# EAGLE schematic LiBatteryChargeBoostBoard (EAGLE 9.6.2)
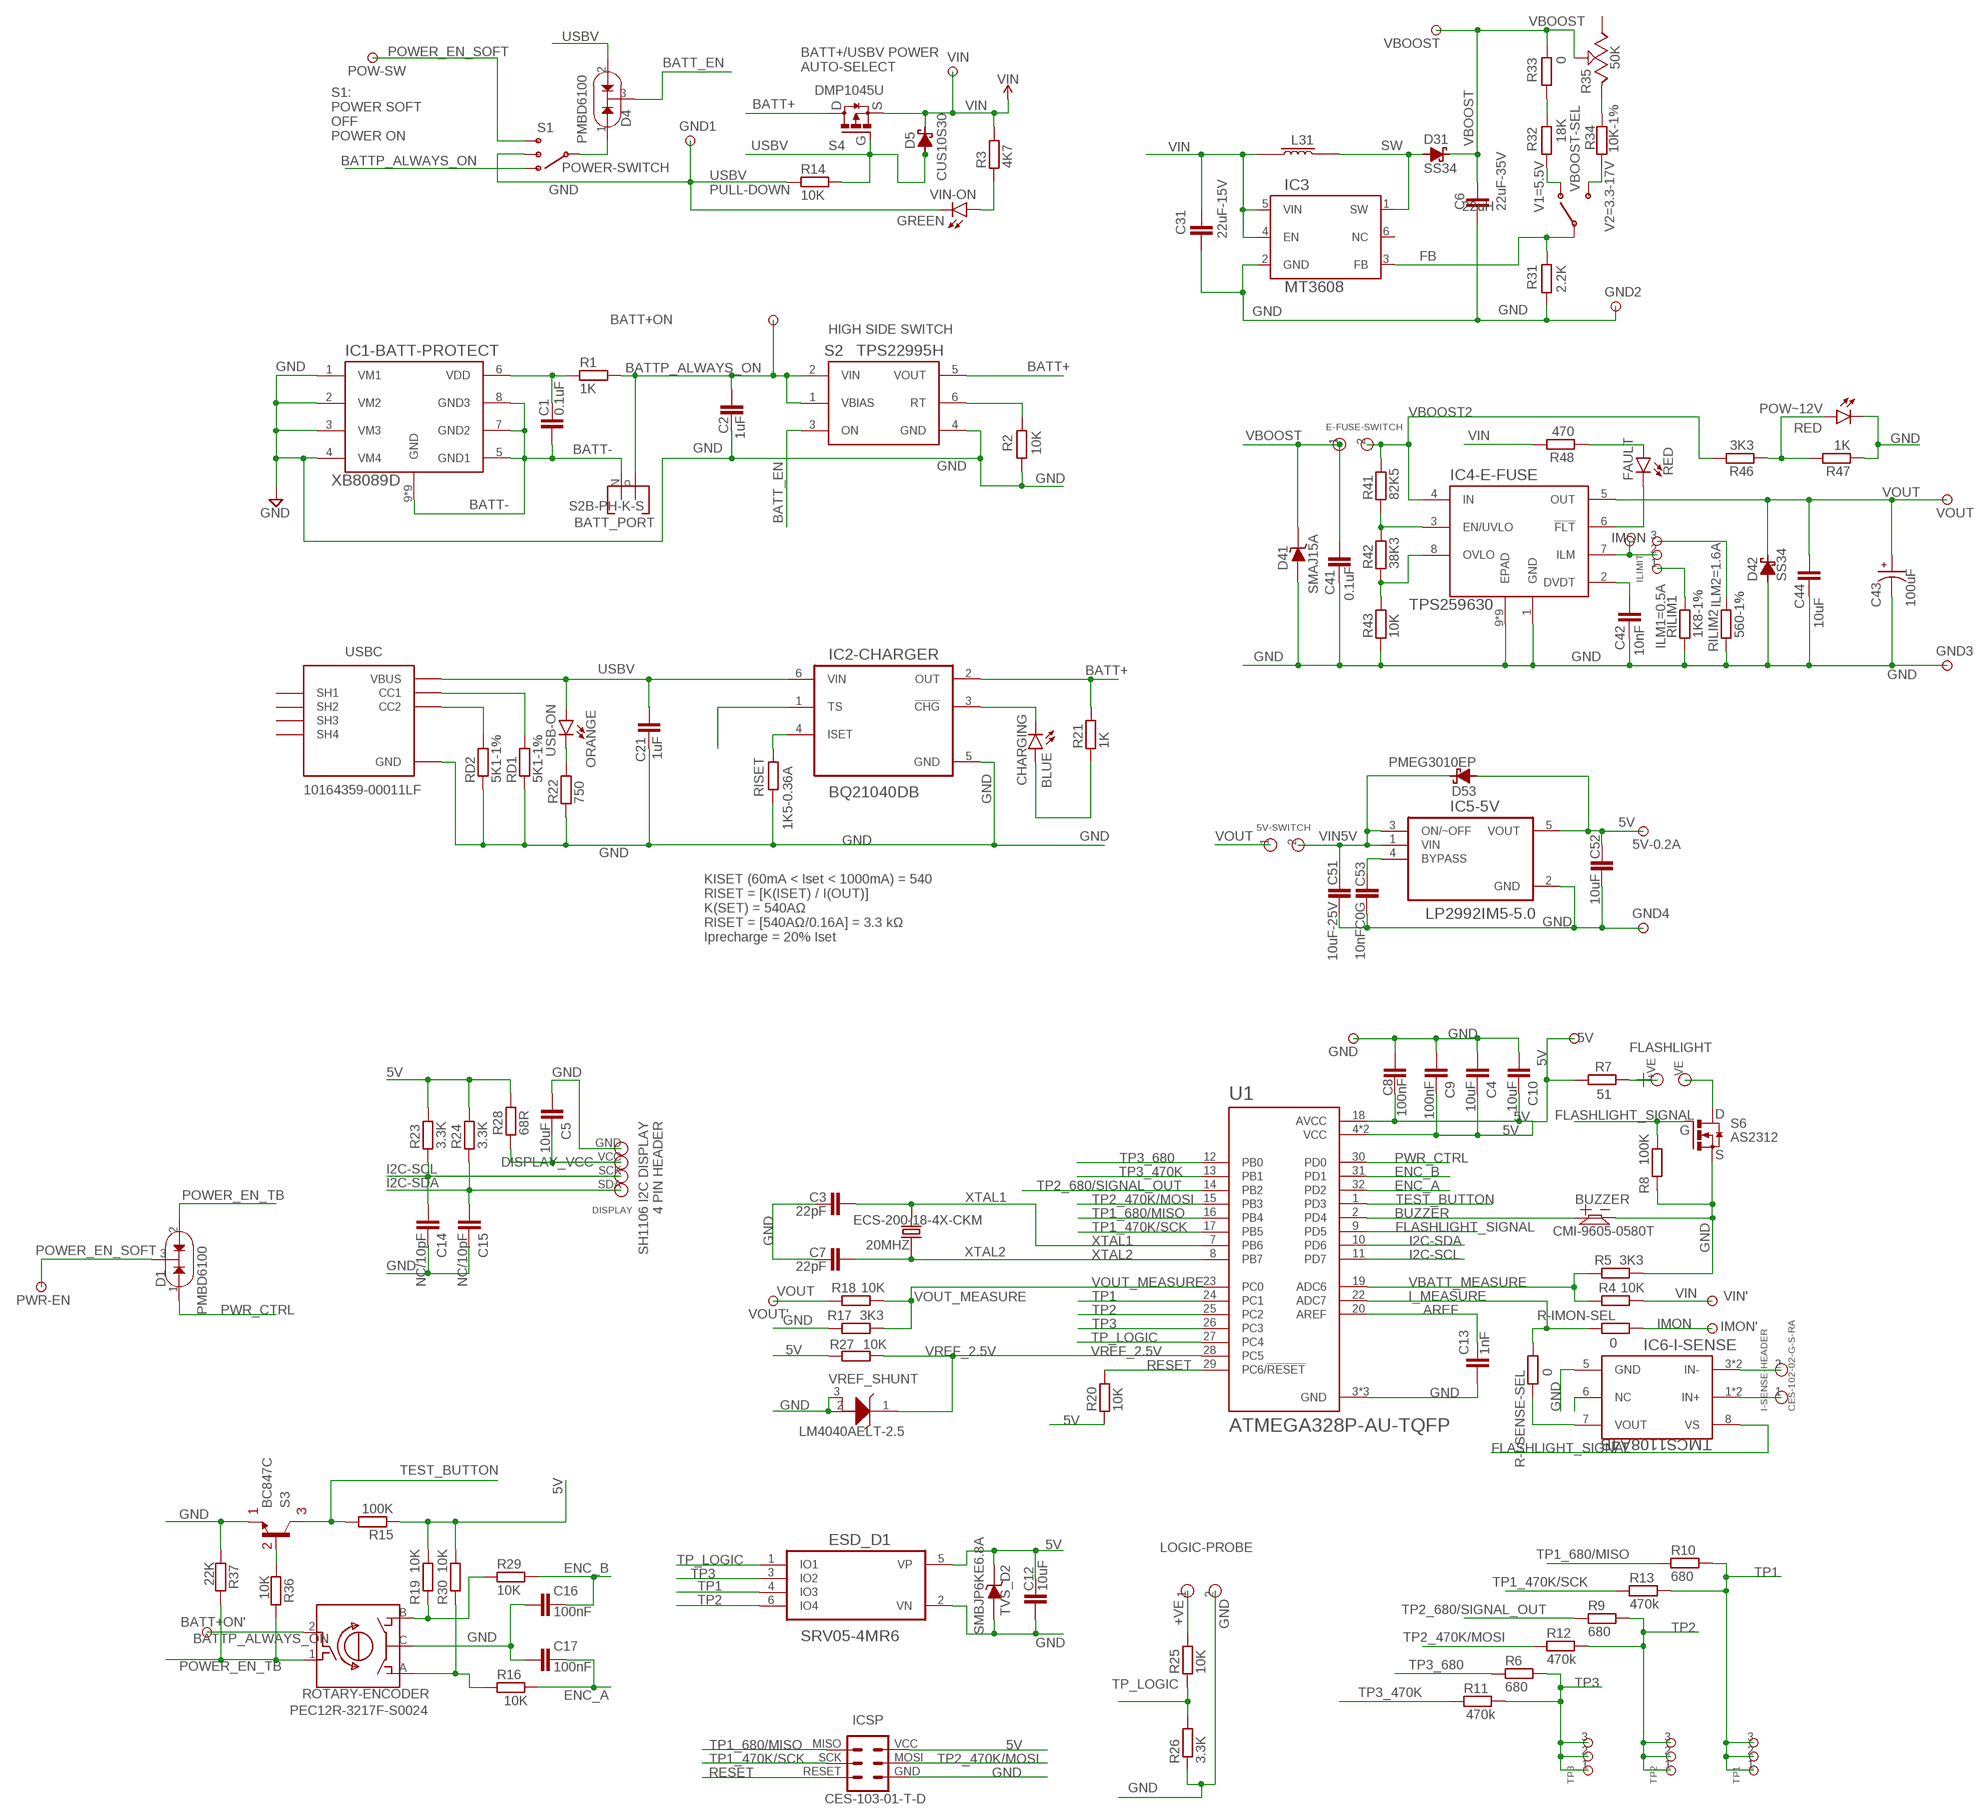
[diagram p0: schematic, sheet 1]

## Parts
5V  TEST-POINT-TH  [TEST-POINT-TH-1MM]
5V-0.2A  TEST-POINT-TH  [TEST-POINT-TH-1MM]
5V-SWITCH  HEADER-2PIN-0.1"P  [HEADER-2PIN-0.1"P]
20MHZ  ECS-200-18-4X-CKM  CRYSTAL-20MHZ-ECS-200-18-4X-CKM  [XTAL_ECS-200-18-4X-CKM]
BATT+ON  TEST-POINT-TH  [TEST-POINT-TH-1MM]
BATT+ON'  TEST-POINT-TH  [TEST-POINT-TH-1MM]
BATT_PORT  S2B-PH-K-S  [S2B-PH-K-S]
BUZZER  CMI-9605-0580T  BUZZER-ACTIVE-CMI-9605-0580T  [BUZZER-ACTIVE-CMI-9605-0580T]
C1  0.1uF  CAPACITOR_SMD0603  [0603]
C2  1uF  CAPACITOR_SMD0603  [0603]
C3  22pF  CAPACITOR_SMD0603  [0603]
C4  10uF  CAPACITOR_SMD0603  [0603]
C5  10uF  CAPACITOR1206  [1206]
C6  22uF-35V  CAPACITOR_SMD1206  [1206]
C7  22pF  CAPACITOR_SMD0603  [0603]
C8  100nF  CAPACITOR_SMD0603  [0603]
C9  100nF  CAPACITOR_SMD0603  [0603]
C10  10uF  CAPACITOR_SMD0603  [0603]
C12  10uF  CAPACITOR_SMD0603  [0603]
C13  1nF  CAPACITOR_SMD0603  [0603]
C14  NC/10pF  CAPACITOR_SMD0603  [0603]
C15  NC/10pF  CAPACITOR_SMD0603  [0603]
C16  100nF  CAPACITOR_SMD0603  [0603]
C17  100nF  CAPACITOR_SMD0603  [0603]
C21  1uF  CAPACITOR_SMD0603  [0603]
C31  22uF-15V  CAPACITOR_SMD1206  [1206]
C41  0.1uF  CAPACITOR_SMD0603  [0603]
C42  10nF  CAPACITOR_SMD0603  [0603]
C43  100uF  EEEFN1E101UP  [CAP_EEEFN1E101UP]
C44  10uF  CAPACITOR_SMD0603  [0603]
C51  10uF-25V  CAPACITOR0603  [0603]
C52  10uF  CAPACITOR0603  [0603]
C53  10nFC0G  CAPACITOR_SMD0603  [0603]
CHARGING  BLUE  LED0603  [0603-DIODE]
D1  PMBD6100  DIODE-DOUBLE-COMMON-CATHODE-PMBD6100,215  [SOT-23-3]
D4  PMBD6100  DIODE-DOUBLE-COMMON-CATHODE-PMBD6100,215  [SOT-23-3]
D5  CUS10S30  DIODE-SCHOTTKY-CUS10S30,H3F  [SOD-323]
D31  SS34  DIODE-SCHOTTKY-SS34  [SMA]
D41  SMAJ15A  DIODE-TVS-SMA  [SMA]
D42  SS34  DIODE-SCHOTTKY-SS34  [SMA]
D53  PMEG3010EP  DIODE-SCHOTTKY-PMEG3010EP,115  [SOD-128]
DISPLAY  DISPLAY-1.3"-SH1106-I2C  [DISPLAY-1.3"-SH1106-I2C]
E-FUSE-SWITCH  HEADER-2PIN-0.1"P  [HEADER-2PIN-0.1"P]
ESD_D1  SRV05-4MR6  SRV05-4MR6T1G  [SOT-23-6]
FAULT  RED  LED0603  [0603-DIODE]
FLASHLIGHT  HEADER-2PIN-0.2"P  [HEADER-2PIN-0.2"P]
GND  TEST-POINT-TH  [TEST-POINT-TH-1MM]
GND1  TEST-POINT-TH  [TEST-POINT-TH-1MM]
GND2  TEST-POINT-TH  [TEST-POINT-TH-1MM]
GND3  TEST-POINT-TH  [TEST-POINT-TH-1MM]
GND4  TEST-POINT-TH  [TEST-POINT-TH-1MM]
I-SENSE-HEADER  CES-102-02-G-S-RA  HEADER-2PIN-0.1"P  [HEADER-2PIN-0.1"P]
IC1-BATT-PROTECT  XB8089D  [SOIC-8-POWER-PAD]
IC2-CHARGER  BQ21040DB  BQ21040DBVR  [SOT-23-6]
IC3  MT3608  [SOT-23-6]
IC4-E-FUSE  TPS259630  TPS259621DDAR  [SOIC-8-POWER-PAD]
IC5-5V  LP2992IM5-5.0  [SOT-23-5]
IC6-I-SENSE  TMCS1108A4B  TMCS1108A4B-CURRENT-SENSE  [SOIC-8]
ICSP  CES-103-01-T-D  HEADER-ICSP-0.1"P  [HEADER-ICSP-0.1"P]
ILIMIT  HEADER-3PIN-0.1"P  [HEADER-3PIN-0.1"P]
IMON  TEST-POINT-TH  [TEST-POINT-TH-1MM]
IMON'  TEST-POINT-TH  [TEST-POINT-TH-1MM]
L31  22uH  INDUCTOR-SMRH74-220MT  [INDUCTOR-SMRH74-220MT]
LOGIC-PROBE  HEADER-2PIN-0.1"P  [HEADER-2PIN-0.1"P]
POW-SW  TEST-POINT-TH  [TEST-POINT-TH-1MM]
POW~12V  RED  LED1206  [1206-DIODE]
PWR-EN  TEST-POINT-TH  [TEST-POINT-TH-1MM]
R1  1K  RESISTOR_SMD0603  [0603]
R2  10K  RESISTOR_SMD0603  [0603]
R3  4K7  RESISTOR_SMD0603  [0603]
R4  10K  RESISTOR_SMD0603  [0603]
R5  3K3  RESISTOR_SMD0603  [0603]
R6  680  RESISTOR_SMD1206  [1206]
R7  51  RESISTOR_SMD1206  [1206]
R8  100K  RESISTOR_SMD0603  [0603]
R9  680  RESISTOR_SMD1206  [1206]
R10  680  RESISTOR_SMD1206  [1206]
R11  470k  RESISTOR_SMD1206  [1206]
R12  470k  RESISTOR_SMD1206  [1206]
R13  470k  RESISTOR_SMD1206  [1206]
R14  10K  RESISTOR_SMD0603  [0603]
R15  100K  RESISTOR_SMD0603  [0603]
R16  10K  RESISTOR_SMD0603  [0603]
R17  3K3  RESISTOR_SMD0603  [0603]
R18  10K  RESISTOR_SMD0603  [0603]
R19  10K  RESISTOR_SMD0603  [0603]
R20  10K  RESISTOR_SMD0603  [0603]
R21  1K  RESISTOR_SMD0603  [0603]
R22  750  RESISTOR_SMD0603  [0603]
R23  3.3K  RESISTOR_SMD0603  [0603]
R24  3.3K  RESISTOR_SMD0603  [0603]
R25  10K  RESISTOR_SMD0603  [0603]
R26  3.3K  RESISTOR_SMD0603  [0603]
R27  10K  RESISTOR_SMD0603  [0603]
R28  68R  RESISTOR_SMD0603  [0603]
R29  10K  RESISTOR_SMD0603  [0603]
R30  10K  RESISTOR_SMD0603  [0603]
R31  2.2K  RESISTOR_SMD0603  [0603]
R32  18K  RESISTOR_SMD0603  [0603]
R33  0  RESISTOR_SMD0603  [0603]
R34  10K-1%  RESISTOR_SMD0603  [0603]
R35  50K  ROTARY-POTENTIOMETER-3386P-1-503TLF  [ROTARY-POTENTIOMETER-3386P]
R36  10K  RESISTOR_SMD0603  [0603]
R37  22K  RESISTOR_SMD0603  [0603]
R41  82K5  RESISTOR_SMD0603  [0603]
R42  38K3  RESISTOR_SMD0603  [0603]
R43  10K  RESISTOR_SMD0603  [0603]
R46  3K3  RESISTOR_SMD0603  [0603]
R47  1K  RESISTOR_SMD0603  [0603]
R48  470  RESISTOR_SMD0603  [0603]
R-I-SENSE-SEL  0  RESISTOR_SMD0603  [0603]
R-IMON-SEL  0  RESISTOR_SMD0603  [0603]
RD1  5K1-1%  RESISTOR_SMD0603  [0603]
RD2  5K1-1%  RESISTOR_SMD0603  [0603]
RILIM1  1K8-1%  RESISTOR_SMD0603  [0603]
RILIM2  560-1%  RESISTOR_SMD0603  [0603]
RISET  1K5-0.36A  RESISTOR_SMD0603  [0603]
ROTARY-ENCODER  PEC12R-3217F-S0024  [PEC12R-3217F-S0024]
S1  POWER-SWITCH  SLIDE-SWITCH-SP3T-VER-TH-MINI  [CSS-1310MC]
S2  TPS22995H  TPS22995H-Q1  [SOT-23-6]
S3  BC847C  [SOT-23-3]
S4  DMP1045U  [SOT-23-3]
S6  AS2312  AS2312AS2312  [SOT-23-3]
TP1  HEADER-3PIN-0.1"P  [HEADER-3PIN-0.1"P]
TP2  HEADER-3PIN-0.1"P  [HEADER-3PIN-0.1"P]
TP3  HEADER-3PIN-0.1"P  [HEADER-3PIN-0.1"P]
TVS_D2  SMBJP6KE6.8A  SMBJP6KE6.8A-TP  [DIOM5336X244N]
U1  ATMEGA328P-AU-TQFP  [TQFP32]
USB-ON  ORANGE  LED0603  [0603-DIODE]
USBC  10164359-00011LF  USB-C-RECEPTABLE-10164359-00011LF  [USB-C-RECEPTABLE-1016435900011LF]
VBOOST  TEST-POINT-TH  [TEST-POINT-TH-1MM]
VBOOST-SEL  SLIDE-SWITCH-SPDT-VERTICLE-TH  [SLW-883935-2A-D]
VIN  TEST-POINT-TH  [TEST-POINT-TH-1MM]
VIN'  TEST-POINT-TH  [TEST-POINT-TH-1MM]
VIN-ON  GREEN  LED0603  [0603-DIODE]
VOUT  TEST-POINT-TH  [TEST-POINT-TH-1MM]
VOUT'  TEST-POINT-TH  [TEST-POINT-TH-1MM]
VREF_SHUNT  LM4040AELT-2.5  LM4040AELT-2.5-SOT23  [SOT-23-3]

## Nets
5V: 5V-0.2A.P$1 5V.P$1 C4.1 C8.2 C9.1 C10.1 C12.1 C52.2 D53.A ESD_D1.5(VP) IC5-5V.5(VOUT) ICSP.VCC R7.1 R15.1 R19.2 R20.1 R23.2 R24.2 R27.1 R28.2 R30.2 TVS_D2.C U1.4(VCC) U1.6(VCC) U1.18(AVCC)
!FLT: FAULT.C IC4-E-FUSE.6(!FLT)
+VE: LOGIC-PROBE.1 R25.2
A: R16.1 R30.1 ROTARY-ENCODER.A
AREF: C13.1 U1.20(AREF)
B: R19.1 R29.1 ROTARY-ENCODER.B
BATT+: IC2-CHARGER.2(OUT) R21.2 S2.5(VOUT) S4.3(D)
BATT-: BATT_PORT.N C1.2 IC1-BATT-PROTECT.5(GND1) IC1-BATT-PROTECT.7(GND2) IC1-BATT-PROTECT.8(GND3) IC1-BATT-PROTECT.9(GND) IC1-BATT-PROTECT.10(GND) IC1-BATT-PROTECT.11(GND) IC1-BATT-PROTECT.12(GND) IC1-BATT-PROTECT.13(GND) IC1-BATT-PROTECT.14(GND) IC1-BATT-PROTECT.15(GND) IC1-BATT-PROTECT.16(GND) IC1-BATT-PROTECT.17(GND)
BATT_EN: D4.3(C) S2.3(ON)
BATTP_ALWAYS_ON: BATT+ON'.P$1 BATT+ON.P$1 BATT_PORT.P C2.2 R1.2 ROTARY-ENCODER.2 S1.1 S2.1(VBIAS) S2.2(VIN)
BJT-B: R36.1 S3.1(B)
BUZZER: BUZZER.P$1 U1.2(PD4)
BYP1: C53.2 IC5-5V.4(BYPASS)
CHG: CHARGING.C IC2-CHARGER.3(!CHG)
DISPLAY_VCC: C5.1 DISPLAY.VCC R28.1
DVDT: C42.2 IC4-E-FUSE.2(DVDT)
EN/UVLO: IC4-E-FUSE.3(EN/UVLO) R41.1 R42.2
ENC_A: C17.1 R16.2 U1.32(PD2)
ENC_B: C16.1 R29.2 U1.31(PD1)
FB: IC3.3(FB) R31.1 VBOOST-SEL.C
FL+: FLASHLIGHT.+VE R7.2
FL-: FLASHLIGHT.-VE S6.3(D)
FLASHLIGHT_SIGNAL: IC6-I-SENSE.8(VS) R8.1 S6.1(G) U1.9(PD5)
GND: BUZZER.P$2 C2.1 C3.1 C4.2 C5.2 C6.1 C7.1 C8.1 C9.2 C10.2 C12.2 C13.2 C14.1 C15.1 C16.2 C17.2 C21.1 C31.1 C41.1 C42.1 C43.2 C44.1 C51.1 C52.1 C53.1 D41.A D42.A DISPLAY.GND ESD_D1.2(VN) GND1.P$1 GND2.P$1 GND3.P$1 GND4.P$1 GND.P$1 IC1-BATT-PROTECT.1(VM1) IC1-BATT-PROTECT.2(VM2) IC1-BATT-PROTECT.3(VM3) IC1-BATT-PROTECT.4(VM4) IC2-CHARGER.5(GND) IC3.2(GND) IC4-E-FUSE.1(GND) IC4-E-FUSE.9(EPAD) IC4-E-FUSE.10(EPAD) IC4-E-FUSE.11(EPAD) IC4-E-FUSE.12(EPAD) IC4-E-FUSE.13(EPAD) IC4-E-FUSE.14(EPAD) IC4-E-FUSE.15(EPAD) IC4-E-FUSE.16(EPAD) IC4-E-FUSE.17(EPAD) IC5-5V.2(GND) IC6-I-SENSE.5(GND) ICSP.GND LOGIC-PROBE.2 POW~12V.C R2.2 R5.2 R8.2 R14.1 R17.1 R22.1 R26.1 R31.2 R37.1 R43.1 R47.1 RD1.1 RD2.1 RILIM1.1 RILIM2.1 RISET.2 ROTARY-ENCODER.C S1.2 S2.4(GND) S3.2(E) S6.2(S) TVS_D2.A U1.3(GND) U1.5(GND) U1.21(GND) USBC.A12(GND) USBC.B12(GND) VIN-ON.C VREF_SHUNT.2(A) VREF_SHUNT.3(NC/A)
I2C-SCL: C14.2 DISPLAY.SCK R23.1 U1.11(PD7)
I2C-SDA: C15.2 DISPLAY.SDA R24.1 U1.10(PD6)
I_MEASURE: R-I-SENSE-SEL.1 R-IMON-SEL.2 U1.22(ADC7)
ILM1: ILIMIT.1 RILIM1.2
ILM2: ILIMIT.3 RILIM2.2
IMEASURE: IC6-I-SENSE.7(VOUT) R-I-SENSE-SEL.2
IMON: IC4-E-FUSE.7(ILM) ILIMIT.2 IMON'.P$1 IMON.P$1 R-IMON-SEL.1
IN+: I-SENSE-HEADER.1 IC6-I-SENSE.1(IN+) IC6-I-SENSE.2(IN+)
IN-: I-SENSE-HEADER.2 IC6-I-SENSE.3(IN-) IC6-I-SENSE.4(IN-)
ISET: IC2-CHARGER.4(ISET) RISET.1
N$1: RD2.2 USBC.B5(CC2)
N$2: RD1.2 USBC.A5(CC1)
N$3: R22.2 USB-ON.C
N$4: R32.2 VBOOST-SEL.1
N$5: R3.1 VIN-ON.A
N$7: FAULT.A R48.1
N$10: CHARGING.A R21.1
N$12: R32.1 R33.2
N$13: R34.2 VBOOST-SEL.2
N$18: POW~12V.A R46.1 R47.2
N$21: R34.1 R35.3(CCW)
NC: IC6-I-SENSE.6(NC)
OVLO: IC4-E-FUSE.8(OVLO) R42.1 R43.2
POWER_EN_SOFT: D1.3(C) POW-SW.P$1 PWR-EN.P$1 S1.3
POWER_EN_TB: D1.2(A2) R36.2 R37.2 ROTARY-ENCODER.1
PWR_CTRL: D1.1(A1) U1.30(PD0)
PWR_SW: D4.1(A1) S1.C
RESET: ICSP.RESET R20.2 U1.29(PC6/!RESET)
RT: R2.1 S2.6(RT)
SW: D31.A IC3.1(SW) L31.P$2
TEST_BUTTON: R15.2 S3.3(C) U1.1(PD3)
TP1: ESD_D1.4(IO3) R10.2 R13.2 TP1.1 TP1.2 TP1.3 U1.24(PC1)
TP1_470K/SCK: ICSP.SCK R13.1 U1.17(PB5)
TP1_680/MISO: ICSP.MISO R10.1 U1.16(PB4)
TP2: ESD_D1.6(IO4) R9.2 R12.2 TP2.1 TP2.2 TP2.3 U1.25(PC2)
TP2_470K/MOSI: ICSP.MOSI R12.1 U1.15(PB3)
TP2_680/SIGNAL_OUT: R9.1 U1.14(PB2)
TP3: ESD_D1.3(IO2) R6.2 R11.2 TP3.1 TP3.2 TP3.3 U1.26(PC3)
TP3_470K: R11.1 U1.13(PB1)
TP3_680: R6.1 U1.12(PB0)
TP_LOGIC: ESD_D1.1(IO1) R25.1 R26.2 U1.27(PC4)
TS: IC2-CHARGER.1(TS)
USBV: C21.2 D4.2(A2) D5.A IC2-CHARGER.6(VIN) R14.2 S4.1(G) USB-ON.A USBC.A9(VBUS) USBC.B9(VBUS)
VBATT_MEASURE: R4.2 R5.1 U1.19(ADC6)
VBOOST: C6.2 C41.2 D31.C D41.C E-FUSE-SWITCH.1 R33.1 R35.2(S) VBOOST.P$1
VBOOST2: E-FUSE-SWITCH.2 IC4-E-FUSE.4(IN) R41.2 R46.2
VDD: C1.1 IC1-BATT-PROTECT.6(VDD) R1.1
VIN: C31.2 D5.C IC3.4(EN) IC3.5(VIN) L31.P$1 R3.2 R4.1 R48.2 S4.2(S) VIN'.P$1 VIN.P$1
VIN5V: 5V-SWITCH.2 C51.2 D53.K(C) IC5-5V.1(VIN) IC5-5V.3(ON/~OFF)
VOUT: 5V-SWITCH.1 C43.1 C44.2 D42.C IC4-E-FUSE.5(OUT) R18.2 VOUT'.P$1 VOUT.P$1
VOUT_MEASURE: R17.2 R18.1 U1.23(PC0)
VREF_2.5V: R27.2 U1.28(PC5) VREF_SHUNT.1(C)
XTAL1: 20MHZ.2 C3.2 U1.7(PB6)
XTAL2: 20MHZ.1 C7.2 U1.8(PB7)
Unconnected: IC3.6(NC) R35.1(CW) USBC.SH1 USBC.SH2 USBC.SH3 USBC.SH4

## Notes on the sheet
- BATT+/USBV POWER
  AUTO-SELECT
- S1:
  POWER SOFT
  OFF
  POWER ON
- USBV
  PULL-DOWN
- V1=5.5V
- V2=3.3-17V
- HIGH SIDE SWITCH
- ILM2=1.6A
- ILM1=0.5A
- KISET (60mA < Iset < 1000mA) = 540
  RISET = [K(ISET) / I(OUT)] 
  K(SET) = 540AΩ
  RISET = [540AΩ/0.16A] = 3.3 kΩ
  Iprecharge = 20% Iset

## Library data of the parts
5V 5V-0.2A BATT+ON BATT+ON' GND GND1-GND4 IMON IMON' POW-SW PWR-EN VBOOST VIN VIN' VOUT VOUT' = .MyComponents:TEST-POINT: TEST POINT
5V-SWITCH E-FUSE-SWITCH I-SENSE-HEADER LOGIC-PROBE = .MyComponents:HEADER-2PIN-0.1"P
20MHZ = .MyComponents:CRYSTAL-20MHZ-ECS-200-18-4X-CKM: 20MHz Crystal Check availability <https://pricing.snapeda.com/parts/ECS-200-18-4X-CKM/ECS%20Inc./view-part?ref=eda>; AVAILABILITY: In Stock; CHECK_PRICES: https://www.snapeda.com/parts/ECS-200-18-4X-CKM/ECS+Inc./view-part/?ref=eda; DATASHEET: https://ecsxtal.com/store/pdf/hc-49usx.pdf; DESCRIPTION: 20 MHz ±10ppm Crystal 18pF 30 Ohms HC-49/US; MF: ECS Inc.; MP: ECS-200-18-4X-CKM; PACKAGE: HC-49US ECS Inc.; PRICE: None; PURCHASE-URL: https://www.snapeda.com/api/url_track_click_mouser/?unipart_id=5049327&manufacturer=ECS Inc.&part_name=ECS-200-18-4X-CKM&search_term=None; SNAPEDA_LINK: https://www.snapeda.com/parts/ECS-200-18-4X-CKM/ECS+Inc./view-part/?ref=snap
BATT_PORT = .MyComponents:S2B-PH-K-S: S2B-PH-K-S JST 2 PIN CONNECTOR RIGHT ANGLE https://www.digikey.com/en/products/detail/jst-sales-america-inc/S2B-PH-K-S/926626
BUZZER = .MyComponents:BUZZER-ACTIVE-CMI-9605-0580T: Active Buzzer WST-0905T https://www.digikey.com/en/products/detail/soberton-inc/WST-0905T/16354847; DATASHEET: https://www.mouser.com/datasheet/2/670/cmi_9605_0580t-1776530.pdf
C1-C4 C6-C10 C12-C17 C21 C31 C41 C42 C44 C53 = .MyComponents:CAPACITOR_SMD: capacitor 1206
C5 = .MyComponents:CAPACITOR1206: capacitor 1206
C43 = .MyComponents:EEEFN1E101UP: Check availability <https://pricing.snapeda.com/parts/EEE-FN1E101UP/Panasonic%20Electronic%20Components/view-part?ref=eda>; AVAILABILITY: In Stock; CHECK_PRICES: https://www.snapeda.com/parts/EEE-FN1E101UP/Panasonic/view-part/?ref=eda; DESCRIPTION: Capacitor,25VDC, 100uF,SMD'Electrolytic | Panasonic Electronic Components EEE-FN1E101UP; MF: Panasonic Electronic Components; MP: EEE-FN1E101UP; PACKAGE: RADIAL-2 Panasonic; PRICE: None; PURCHASE-URL: https://www.snapeda.com/api/url_track_click_mouser/?unipart_id=6178105&manufacturer=Panasonic Electronic Components&part_name=EEE-FN1E101UP&search_term=eee-fn1e101up; SNAPEDA_LINK: https://www.snapeda.com/parts/EEE-FN1E101UP/Panasonic/view-part/?ref=snap
C51 C52 = .MyComponents:CAPACITOR0603: capacitor 0603
CHARGING FAULT POW~12V USB-ON VIN-ON = .MyComponents:LED
D1 D4 = .MyComponents:DIODE-DOUBLE-COMMON-CATHODE-PMBD6100,215: Dual diode common cathode Mouser <https://www.mouser.com/ProductDetail/Nexperia/PMBD6100215?qs=LOCUfHb8d9u7I2YFYtMbTg%3D%3D> Datasheet <https://www.mouser.com/datasheet/2/916/PMBD6100-2938376.pdf> single diode loaded − 215 mA double diode loaded − 125 mA continuous reverse voltage − 70 V repetitive peak reverse voltage − 85 V IFRM repetitive peak forward current − 450 mA IFSM non-repetitive peak forward current square wave; Tj = 25 °C prior to surge; see Fig.4 t = 1 µs − 4 A t = 1 ms − 1 A t = 1 s − 0.5 A VF forward voltage see Fig.3 IF = 1 mA 550 700 mV IF = 10 mA − 855 mV IF = 50 mA − 1 V IF = 100 mA 0.85 1.1 V IR reverse current see Fig.5 VR = 50 V − 100 nA VR = 50 V; Tj = 150 °C − 50 µA; DATASHEET: https://www.mouser.com/datasheet/2/916/PMBD6100-2938376.pdf; VALUE: PMBD6100,215
D5 = .MyComponents:DIODE-SCHOTTKY-CUS10S30,H3F: CUS10S30,H3F Diode 30 V 1A Surface Mount USC DigiKey <https://www.digikey.com/en/products/detail/toshiba-semiconductor-and-storage/CUS10S30-H3F/5114299> Datasheet <https://toshiba.semicon-storage.com/info/CUS10S30_datasheet_en_20140407.pdf?did=14077&prodName=CUS10S30> Electrical Characteristics (Unless otherwise specified, Ta = 25 ) Forward voltage VF(1) IF = 0.1 A (Pulse test) 0.23V Forward voltage VF(2) IF = 0.5 A (Pulse test) 0.31V Forward voltage VF(3) IF = 1 A (Pulse test) 0.37V - 0.45V(max) Reverse current IR VR = 30 V (Pulse test) 0.2mA - 0.5mA(max) Total capacitance Ct VR = 0 V, f = 1 MHz 135pF
D31 D42 = .MyComponents:DIODE-SCHOTTKY-SS34: Part Number: SS34 / Forward Current : 3 A / Maxixum Repetitive Peak Reverse Voltage : 40 V High Forward Surge Current Capability / High Temperature Soldering / Low Power Loss,High Efficiency datasheet <https://mm.digikey.com/Volume0/opasdata/d220001/medias/docus/5335/SMASS340000S34.pdf>
D41 = .MyComponents:DIODE-TVS-
D53 = .MyComponents:DIODE-SCHOTTKY-PMEG3010EP,115: Diode 30 V 1A Surface Mount SOD-128/CFP5 Nexperia USA Inc. DigiKey <https://www.digikey.com/en/products/detail/nexperia-usa-inc/PMEG3010EP-115/2676893> Datasheet <https://assets.nexperia.com/documents/data-sheet/PMEG3010EP.pdf> reverse current VR = 30 V; Tj = 25 °C - 0.6 1.5 mA reverse voltage Tj = 25 °C - - 30 V forward voltage IF = 1 A; Tj = 25 °C - 320 360 mV
DISPLAY = .MyComponents:DISPLAY-1.3"-SH1106-I2C: SH1106 I2C DISPLAY https://www.amazon.com/dp/B0C3L54TL6
ESD_D1 = .MyComponents:SRV05-4MR6T1G: ESD Circuit Protection 17.5V Clamp 5A (8/20µs) Ipp Tvs Diode Surface Mount 6-TSOP DigiKey <https://www.digikey.com/en/products/detail/onsemi/SRV05-4MR6T1G/2652020> Check availability <https://pricing.snapeda.com/parts/SRV05-4MR6T1G/ON%20Semiconductor/view-part?ref=eda>; AVAILABILITY: In Stock; CHECK_PRICES: https://www.snapeda.com/parts/SRV05-4MR6T1G/Onsemi/view-part/?ref=eda; DESCRIPTION: 17.5V Clamp 5A (8/20µs) Ipp Tvs Diode Surface Mount 6-TSOP; MF: ON Semiconductor; MP: SRV05-4MR6T1G; PACKAGE: TSOP-6 ON Semiconductor; PRICE: None; PURCHASE-URL: https://www.snapeda.com/api/url_track_click_mouser/?unipart_id=95760&manufacturer=ON Semiconductor&part_name=SRV05-4MR6T1G&search_term=None; SNAPEDA_LINK: https://www.snapeda.com/parts/SRV05-4MR6T1G/Onsemi/view-part/?ref=snap
FLASHLIGHT = .MyComponents:HEADER-2PIN-0.2"P: 5MM 2 PIN HEADER
IC1-BATT-PROTECT = .MyComponents:XB8089D: XB8089D One Cell Lithium-ion/Polymer Battery Protection IC datasheet <https://datasheet.lcsc.com/lcsc/1811151452_XySemi-XB8089D_C79928.pdf> FEATURES ·Protection of Charger Reverse Connection ·Protection of Battery Cell Reverse Connection ·Integrate Advanced Power MOSFET with Equivalent of 20mΩ RSS(ON) ·SOP8-PP Package ·Only One External Capacitor Required ·Over-temperature Protection ·Overcharge Current Protection ·Two-step Overcurrent Detection: -Overdischarge Current -Load Short Circuiting ·Charger Detection Function ·0V Battery Charging Function - Delay Times are generated inside ·High-accuracy Voltage Detection ·Low Current Consumption - Operation Mode:6μ A typ. - Power-down Mode: 3μ A typ. ·RoHS Compliant and Lead (Pb) Free PART NUMBER Packa ge Overcharg e Detection Voltage [VCU] (V) Overcharge Release Voltage [VCL] (V) Overdischarge Detection Voltage [VDL] (V) Overdischarge Release Voltage [VDR] (V) Overcurrent Detection Current [IOV1] (A) Top Mark XB8089D SOP8 -PP 4.250 4.10 2.50 3.0 10.0 XB8089DYW(note)
IC2-CHARGER = .MyComponents:BQ21040DBVR: battery charger Check Availability <https://pricing.snapeda.com/parts/BQ21040DBVR/Texas%20Instruments/view-part?ref=eda>; AVAILABILITY: In Stock; CHECK_PRICES: https://www.snapeda.com/parts/BQ21040DBVR/Texas+Instruments/view-part/?ref=eda; DESCRIPTION: 1-cell, 0.8-A Li-ion and Li-polymer battery charger; MF: Texas Instruments; MP: BQ21040DBVR; PACKAGE: SOT-23-6 Texas Instruments; PRICE: None; PURCHASE-URL: https://www.snapeda.com/api/url_track_click_mouser/?unipart_id=505197&manufacturer=Texas Instruments&part_name=BQ21040DBVR&search_term=bq21040dbvr; SNAPEDA_LINK: https://www.snapeda.com/parts/BQ21040DBVR/Texas+Instruments/view-part/?ref=snap
IC3 = .MyComponents:MT3608: High Efficiency 1.2MHz 2A Step Up Converter datasheet <https://www.mouser.com/datasheet/2/306/MT3608-3223743.pdf> Circuit <https://oshwlab.com/Little_Arc/MT3608> • Integrated 80mΩ Power MOSFET • 2V to 24V Input Voltage • 1.2MHz Fixed Switching Frequency • Internal 4A Switch Current Limit • Adjustable Output Voltage • Internal Compensation • Up to 28V Output Voltage • Automatic Pulse Frequency Modulation Mode at Light Loads • up to 97% Efficiency • Available in a 6-Pin SOT23-6 Package
IC4-E-FUSE = .MyComponents:TPS259621DDAR: Electronic Fuse Regulator 2A 8-SO PowerPad Texas Instruments TPS259621DDAR The TPS2596xx family of eFuses (integrated FET hot-swap devices) is a highly integrated circuit protection and power management solution in a small package. datasheet <https://www.ti.com/lit/ds/symlink/tps2596.pdf> DigiKey <https://www.digikey.com/en/products/detail/texas-instruments/TPS259621DDAR/10445382>
IC5-5V = .MyComponents:LP2992IM5-5.0: LP2992 Micropower 250-mA Low-Noise Ultra-Low-Dropout Regulator in SOT-23 and WSON Packages Designed for Use With Very Low-ESR Output Capacitors Datasheet <https://www.ti.com/lit/ds/symlink/lp2992.pdf> DigiKey <https://www.digikey.com/en/products/detail/texas-instruments/LP2992IM5-5-0-NOPB/483036> Input Voltage Range: 2.2 V to 16 V Output Voltage Range: 1.5 V to 5 V Output Voltage Accuracy 1% (A Grade); AVAILABILITY: In Stock; CHECK_PRICES: https://www.snapeda.com/parts/LP2992IM5-5.0/NOPB/Texas+Instruments/view-part/?ref=eda; DESCRIPTION: 250-mA, 16-V, low-dropout voltage regulator with enable; MF: Texas Instruments; MP: LP2992IM5-5.0/NOPB; PACKAGE: SOT-23-5 Texas Instruments; PRICE: None; PURCHASE-URL: https://www.snapeda.com/api/url_track_click_mouser/?unipart_id=26545&manufacturer=Texas Instruments&part_name=LP2992IM5-5.0/NOPB&search_term=lp2992im5-5.0/nopb; SNAPEDA_LINK: https://www.snapeda.com/parts/LP2992IM5-5.0/NOPB/Texas+Instruments/view-part/?ref=snap
IC6-I-SENSE = .MyComponents:TMCS1108A4B-CURRENT-SENSE: TMCS1108A4BQDR Current Sensor 1 Channel Hall Effect Bidirectional 8-SOIC (0.154", 3.90mm Width) DigiKey <https://www.digikey.com/en/products/detail/texas-instruments/TMCS1108A4BQDR/13692775> Datasheet <https://www.ti.com/lit/ds/symlink/tmcs1108.pdf?HQS=dis-dk-null-digikeymode-dsf-pf-null-wwe&ts=1700509354002>
ICSP = .MyComponents:HEADER-ICSP-0.1"P: ISP HEADER 2X3 2.54MM
ILIMIT TP1-TP3 = .MyComponents:HEADER-3PIN-0.1"P
L31 = .MyComponents:INDUCTOR-SMRH74-220MT: 22uH Inductor +-20% SMRH Series, Shielded SMD Power Inductors Max DCR 0.170 Ohm Saturation Current 1.23A datasheet <https://datasheet.lcsc.com/lcsc/2108131530_SXN-Shun-Xiang-Nuo-Elec-SMRH74-220MT_C27442.pdf>
R1-R34 R36 R37 R41-R43 R46-R48 R-I-SENSE-SEL R-IMON-SEL RD1 RD2 RILIM1 RILIM2 RISET = .MyComponents:RESISTOR_SMD: resistor smd
R35 = .MyComponents:ROTARY-POTENTIOMETER-: 50 kOhms 0.5W, 1/2W PC Pins Through Hole Trimmer Potentiometer Cermet 1.0 Turn Top Finger Adjustment DigiKey <https://www.digikey.com/en/products/detail/bourns-inc/3386P-1-503TLF/1232551>
ROTARY-ENCODER = .MyComponents:PEC12R-3217F-S0024: Rotary Encoder with Push Button and Bushing Bourns Inc digikey <https://www.digikey.com/en/products/detail/bourns-inc/PEC12R-3217F-S0024/6153383>
S1 = .MyComponents:SLIDE-SWITCH-SP3T-: CUI Devices Slide Switch SP3T SLW-1516255-6A-RA-D Right Angle TH <https://www.digikey.com/en/products/detail/cui-devices/SLW-1516255-6A-RA-D/21259965>
S2 = .MyComponents:TPS22995H-Q1: 5.5-V, 3-A, 19-mΩ On-Resistance Automotive Load Switch DigiKey <https://www.digikey.com/en/products/detail/texas-instruments/TPS22995HQDDCRQ1/17394924> • Input operating voltage range (VIN): 0.8 V–5.5 V • Bias voltage supply (VBIAS): 1.5 V–5.5 V • Maximum continuous current: 3 A • ON-resistance (RON): 19 mΩ (typ.) • Adjustable slew rate control through external resistor • Quick Output Discharge (QOD): 100 Ω (typ.) • Thermal shutdown • Smart ON pin pulldown (RPD,ON): • – ON ≥ VIH (ION): 25 nA (max.) – ON ≤ VIL (RPD,ON): 500 kΩ (typ.) • Low power consumption: – ON state (IQ): 10 µA (typ.) – OFF state (ISD): 0.1 µA (typ.)
S3 = .MyComponents:BC847C: BC847C Bipolar (BJT) Transistor NPN 45 V 100 mA 300MHz 200 mW Surface Mount SOT-23 https://www.digikey.com/en/products/detail/good-ark-semiconductor/BC847C/18648944
S4 = .MyComponents:DMP1045U: DMP1045U PMOSFET SOT-23-3 VDSS -12V RDS(ON) Max ID 31mΩ @ VGS = -4.5V 5.2A 45mΩ @ VGS =-2.5V 4.3A ON CHARACTERISTICS Gate Threshold Voltage VGS(TH) -0.3 -0.55 -1.0 V Diode Forward Voltage VSD — -0.6 — V ABSOLUTE MAXIMUM RATINGS (@TA = +25°C, unless otherwise specified.) Characteristic Symbol Value Units Drain-Source Voltage VDSS -12 V Gate-Source Voltage VGSS ±8 V DYNAMIC CHARACTERISTICS Input Capacitance CISS — 1357 — pF Output Capacitance COSS — 504 — pF Reverse Transfer Capacitance CRSS — 235 — pF Gate Resistnace RG — 14.1 — Ω SWITCHING CHARACTERISTICS (Note 8) Total Gate Charge QG — 15.8 — nC Gate-Source Charge QGS — 2.0 — nC Gate-Drain Charge QGD — 3.9 — nC Turn-On Delay Time tD(ON) — 15.7 — ns Turn-On Rise Time tR — 23.3 — ns Turn-Off Delay Time tD(OFF) — 91.2 — ns Turn-Off Fall Time tF — 106.9 — ns
S6 = .MyComponents:AS2312: AS2312 N-Channel 20 V 6.8A (Ta) 1.2W (Ta) Surface Mount SOT-23 https://www.digikey.com/en/products/detail/anbon-semiconductor-int-l-limited/AS2312/16708465
TVS_D2 = .MyComponents:SMBJP6KE6.8A-TP: SMBJ Series 600 W 6.8 V Uni-Directional Surface Mount TVS Diode - SMB; CHECK_PRICES: https://www.snapeda.com/parts/SMBJP6KE6.8A-TP/Micro+Commercial+Components/view-part/?ref=eda; DESCRIPTION: 10.5V Clamp 58.1A Ipp Tvs Diode Surface Mount DO-214AA (SMBJ); DIGIKEY_PART_NUMBER: SMBJP6KE6.8A-TPMSTR-ND; MF: Micro Commercial; MP: SMBJP6KE6.8A-TP; PACKAGE: DO-214 MCC; PURCHASE-URL: https://www.snapeda.com/api/url_track_click_mouser/?unipart_id=577204&manufacturer=Micro Commercial&part_name=SMBJP6KE6.8A-TP&search_term=smbjp6ke6.8a; SNAPEDA_LINK: https://www.snapeda.com/parts/SMBJP6KE6.8A-TP/Micro+Commercial+Components/view-part/?ref=snap
U1 = .MyComponents:ATMEGA328P-AU-TQFP: Check availability <https://pricing.snapeda.com/parts/ATMEGA328P-AU/Microchip/view-part?ref=eda>; AVAILABILITY: In Stock; CHECK_PRICES: https://www.snapeda.com/parts/ATMEGA328P-AU/Microchip/view-part/?ref=eda; DESCRIPTION: AVR AVR® ATmega Microcontroller IC 8-Bit 20MHz 32KB (16K x 16) FLASH 32-TQFP (7x7); MF: Microchip; MP: ATMEGA328P-AU; PACKAGE: TQFP-32 Microchip; PRICE: None; PURCHASE-URL: https://www.snapeda.com/api/url_track_click_mouser/?unipart_id=44280&manufacturer=Microchip&part_name=ATMEGA328P-AU&search_term=atmega328p-au; SNAPEDA_LINK: https://www.snapeda.com/parts/ATMEGA328P-AU/Microchip/view-part/?ref=snap
USBC = .MyComponents:USB-C-RECEPTABLE-10164359-00011LF: USB-C (USB TYPE-C) Receptacle Connector 24 (6+18 Dummy) Position Surface Mount, Right Angle; Through Hole USB Type C Receptacle SMT Single Row 6Pin Source: Datasheet <https://cdn.amphenol-cs.com/media/wysiwyg/files/drawing/10164359.pdf> Check availability <https://pricing.snapeda.com/parts/10164359-00011LF/Amphenol%20FCI/view-part?ref=eda>; AVAILABILITY: In Stock; CHECK_PRICES: https://www.snapeda.com/parts/10164359-00011LF/Amphenol/view-part/?ref=eda; DESCRIPTION: USB Type C Receptacle SMT Single Row 6Pin; MF: Amphenol FCI; MP: 10164359-00011LF; PACKAGE: None; PRICE: None; PURCHASE-URL: https://www.snapeda.com/api/url_track_click_mouser/?unipart_id=11778037&manufacturer=Amphenol FCI&part_name=10164359-00011LF&search_term=10164359-00011lf; SNAPEDA_LINK: https://www.snapeda.com/parts/10164359-00011LF/Amphenol/view-part/?ref=snap
VBOOST-SEL = .MyComponents:SLIDE-SWITCH-SPDT-: spdt slide switch SLW-883935-2A-D verticle th <https://www.digikey.com/en/products/detail/cui-devices/SLW-883935-2A-D/21259966> SLW-913535-2A-RA-D Right Angle Th <https://www.digikey.com/en/products/detail/cui-devices/SLW-913535-2A-RA-D/21259973>
VREF_SHUNT = .MyComponents:LM4040AELT-2.5-SOT23: STMicroelectronics Shunt Voltage Reference IC Fixed 2.5V V ±0.1% 15 mA SOT-23-3 https://www.digikey.com/en/products/detail/stmicroelectronics/LM4040AELT-2-5/16184070 https://www.mouser.com/ProductDetail/511-LM4040AELT-2.5; DATASHEET: https://www.st.com/resource/en/datasheet/lm4040.pdf

## Net classes
0 default: clearance 0.205 mm